# EAGLE design ESP8266_v2 (EAGLE 9.0.0)
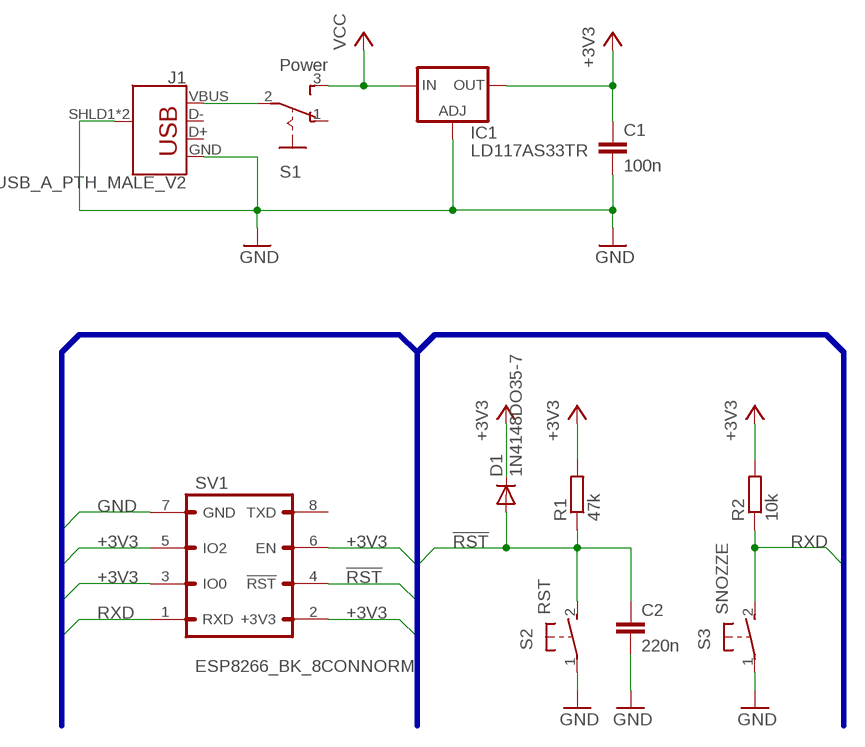
[diagram p0: schematic, sheet 1]

## Parts
C1  100n  C-EU050-025X075  [C050-025X075]
C2  220n  C-EU050-025X075  [C050-025X075]
D1  1N4148DO35-7  [DO35-7]
IC1  LD117AS33TR  [SOT223]
J1  USB_A_PTH_MALE_V2  [USB-A-H-V2]
R1  47k  R-EU_0204/5  [0204/5]
R2  10k  R-EU_0204/5  [0204/5]
S1  Power  255SBSMALL-H  [255SB-B]
S2  RST  SWITCH_2PIN  [DT6-1]
S3  SNOZZE  SWITCH_2PIN  [DT6-1]
SV1  ESP8266_BK_8CONNORM  [ESP8266_8CON]

## Nets
!RST: C2.1 D1.A R1.1 S2.2(S) SV1.4(!RST)
+3V3: C1.1 D1.C IC1.2(OUT) IC1.4(OUT) R1.2 R2.2 SV1.2(+3V3) SV1.3(IO0) SV1.5(IO2) SV1.6(EN)
GND: C1.2 C2.2 IC1.1(ADJ) J1.GND J1.SHLD1(SHIELD) J1.SHLD2(SHIELD) S2.1(P) S3.1(P) SV1.7(GND)
N$1: J1.VBUS S1.2(P)
RXD: R2.1 S3.2(S) SV1.1(RXD)
VCC: IC1.3(IN) S1.3(S)
Unconnected: J1.D+ J1.D- S1.1(O) SV1.8(TXD)

## Buses
VCC_0,VCC,VBUS,GND,+3V3,DTR,RXD,TXD,CTS,D+,D-,IO[0..2],!EN,!RST

## Library data of the parts
C1 C2 = Custom:C-EU: CAPACITOR, European symbol
D1 = Custom:1N4148: DIODE high speed (Philips)
IC1 = Custom:LD117A?*: Low drop fixed and adjustable positive voltage regulators 1 A Source: http://www.st.com/stonline/products/literature/ds/7194/ld1117axx.pdf
J1 = Custom:USB_A: USB-A Connector Male and female variants, as well as PTH and SMT variants SparkFun Products: SparkFun XBee Explorer Dongle <https://www.sparkfun.com/products/11697> PTH Male SparkFun MicroView-USB Programmer <https://www.sparkfun.com/products/12924> SMT Male SparkFun USB Type A Female Breakout <https://www.sparkfun.com/products/12700> SMT Female
R1 R2 = Custom:R-EU_: RESISTOR, European symbol
S1 = Custom:255SB: SLIDING SWITCH Distributor Buerklin, 11G810
S2 S3 = Custom:SWITCH_2PIN: ITT SWITCH
SV1 = Custom:ESP8266_BK_8CON: PIN HEADER

## Board
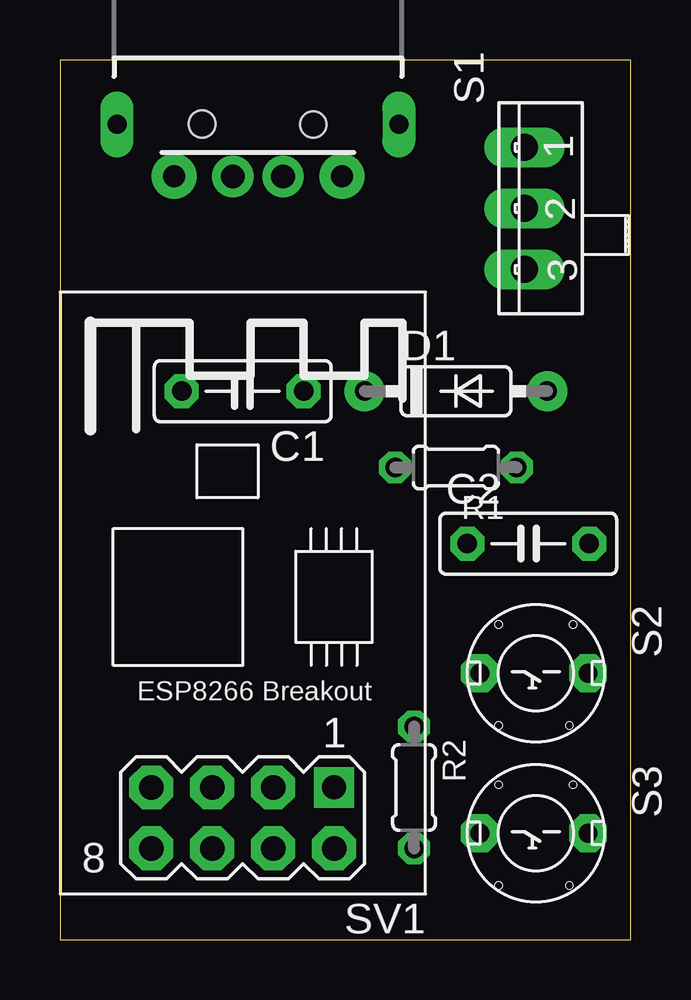
[diagram p1: board, top side]
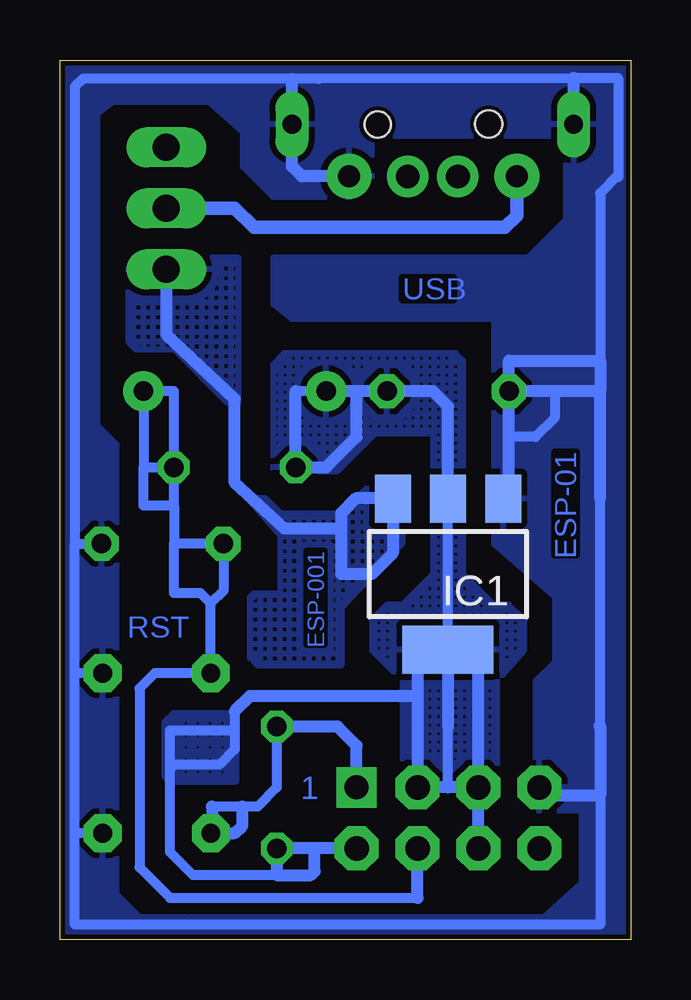
[diagram p2: board, bottom side, seen from below]

Size 23.8 x 36.66 mm. Coordinates in mm from the lower left corner, seen from the top.
Outline: 0,0 23.8,0 23.8,36.66 0,36.66 0,0
Copper layers (1*16): Top 0.035mm / dielectric 1.5mm / Bottom 0.035mm
Design rules "default *": minimum track width 6mil, minimum drill 0.35mm, track to track 6mil, track to pad 6mil, pad to pad 6mil, via to via 6mil, smd to smd 6mil, copper to edge 8mil, drill to drill 6mil, minimum pad ring 10mil, minimum via ring 8mil, stop-mask expansion 4mil, vias tented up to drill 0mil, thermal gap 10mil

### Footprints (pad centres in the part's own frame; a part is rotated, then mirrored left to right if it is on the bottom)
C050-025X075 = drill 0.813 pad 1.422 octagon: 1 -2.54,0; 2 2.54,0
DO35-7 = drill 0.813 pad 1.676: A 3.81,0; C -3.81,0
SOT223 = smd 1.5 x 2: 1 -2.3,-3.15; 2 0,-3.15; 3 2.3,-3.15 | smd 3.8 x 2: 4 0,3.15
USB-A-H-V2 = drill 0.991 pad 1.727: D+ 2.162,1.048; D- 2.162,-1.048 | drill 0.914 pad 1.88: GND 2.162,3.5; VBUS 2.162,-3.5 | drill 0.787 pad 1.372 long: SHLD1 -0.006,-5.874; SHLD2 -0.006,5.874 | hole 1.092: 0,2.302 | hole 1.118: -0.021,-2.329
0204/5 = drill 0.813 octagon: 1 -2.54,0; 2 2.54,0
255SB-B = drill 1.118 long: 1 -2.54,0; 2 0,0; 3 2.54,0
DT6-1 = drill 0.787 pad 1.575 octagon: 1 0,2.178; 2 0,-2.334
ESP8266_8CON = drill 1 pad 1.676 square: 1 -3.81,-1.27 | drill 1.016 pad 1.829 octagon: 2 -3.81,1.27; 3 -1.27,-1.27; 4 -1.27,1.27; 5 1.27,-1.27; 6 1.27,1.27; 7 3.81,-1.27; 8 3.81,1.27

### Placement (x,y rotation side)
C1  7.62,22.86 180 top
C2  19.53,16.51 0 top
D1  16.51,22.86 0 top
IC1  7.62,15.24 180 bottom
J1  8.26,33.97 270 top
R1  16.51,19.68 180 top
R2  14.76,6.35 270 top
S1  19.37,30.48 270 top
S2  19.84,11.11 270 top
S3  19.84,4.44 270 top
SV1  7.62,5.08 180 top

### Tracks (layer width: path | path; a pad name or v marks a point on that pad's centre or on a via)
!RST
  Bottom 0.406: 20.32,19.68 D1.A 19.05,22.86 R1.1 | 20.32,19.68 R1.1 | 19.05,18.1 R1.1 | 19.05,18.1 20.32,18.1 20.32,19.68 | 17.51,16.46 C2.1 | 8.89,1.75 19.21,1.75 20.48,3.02 20.48,10.48 19.84,11.11 S2.2 17.51,14.02 | C2.1 19.05,16.51 | 19.05,18.1 19.05,16.51 | C2.1 16.99,14.54 17.51,14.02 | 17.51,14.02 17.94,14.45 19.05,14.45 19.05,16.51
  Bottom 0.508: 8.89,1.75 SV1.4
+3V3
  Bottom 0.406: 6.35,12.07 7.59,12.07 IC1.4 | IC1.4 8.87,12.09 8.89,12.07 | IC1.4 IC1.2 | D1.C 13.97,22.86 | 8.89,10.32 9.05,10.16 | 19.21,7.14 19.21,8.73 16.51,8.73 | 19.21,7.14 19.21,3.65 18.26,2.7 14.76,2.7 | 16.51,9.53 16.51,8.73 | 16.51,8.73 16.51,7.94 17.14,7.3 19.05,7.3 19.21,7.14 | 8.57,6.35 8.89,6.67 | 7.62,6.35 7.62,10.16
  Bottom 0.508: IC1.2 7.62,22.22 8.26,22.86 C1.1 11.43,22.86 | 11.43,22.86 D1.C | SV1.6 SV1.5 | IC1.4 7.62,10.16 7.62,8.89 | SV1.5 6.35,12.07 | 8.89,12.07 8.89,10.32 8.89,6.67 SV1.3 | 11.43,22.86 11.43,20.95 12.7,19.68 R1.2 13.97,22.86 | SV1.2 13.18,3.81 | 13.18,3.81 R2.2 14.76,2.7 13.34,2.7 13.18,2.86 13.18,3.81 | 16.51,9.53 15.88,10.16 9.05,10.16 | SV1.5 7.62,6.35 8.57,6.35
  pour Bottom (hatched): 7.3,24.45 14.45,24.45 14.92,23.97 14.92,19.53 12.22,19.53 10.64,21.11 8.26,21.11 8.26,15.24 9.53,13.97 10.16,13.97 10.79,13.34 10.79,12.07 9.53,10.79 9.53,6.35 5.56,6.35 5.56,10.79 4.45,12.07 4.45,13.34 5.08,13.97 5.71,13.97 6.99,15.24 6.99,24.13
  pour Bottom (hatched): 16.51,9.37 19.05,9.37 19.37,9.05 19.37,6.83 19.05,6.67 16.51,6.67
GND
  Bottom 0.406: 23.18,16.51 23.18,35.56 22.86,35.88 14.13,35.88 13.02,35.88 2.38,35.91 2.25,35.91 0.52,35.91 0.52,31.79 0.52,31.87 1.27,31.12 1.27,24.13 | 23.18,16.51 C2.2 | 1.27,8.89 1.27,18.41 | 3.17,22.86 3.17,21.75 3.97,20.95 5.08,20.95 | 1.27,6.03 1.27,0.64 23.18,0.64 23.18,4.44 | 23.18,4.44 23.18,11.11 | 23.18,11.11 23.18,16.51 | S2.1 23.18,11.11 | S3.1 23.18,4.44
  Bottom 0.508: 1.27,22.86 1.27,24.13 5.08,24.13 C1.2 | 1.27,22.86 3.17,22.86 C1.2 | 1.27,18.41 1.27,22.86 | IC1.1 5.08,18.63 5.08,20.95 C1.2 | 1.29,8.92 1.27,8.89 1.27,6.03 3.81,6.03 SV1.7 | 14.13,35.88 J1.SHLD2 14.13,32.23 13.71,31.81 J1.GND | J1.SHLD1 2.38,35.91 | 2.38,35.91
  pour Bottom: 3.97,5.4 2.06,5.4 2.06,2.38 3.65,0.95 18.41,0.95 18.41,0 0,0 0,36.67 23.81,36.67 23.81,0 18.57,0 18.57,0.95 20.48,0.95 21.43,1.91 21.43,20.64 22.23,21.43 22.23,34.45 21.59,34.92 17.62,34.92 16.19,33.66 16.19,32.23 14.92,30.96 10.79,30.96 10.79,33.5 2.7,33.5 2.7,30 4.29,28.42 14.92,28.42 14.92,26.51 14.13,25.88 5.71,25.88 5.71,16.51 3.17,14.29 3.17,11.59 3.97,10.79
N$1
  Bottom 0.559: J1.VBUS 4.75,30.17 5.24,29.69 15.72,29.69 16.51,30.48 S1.2
RXD
  Bottom 0.406: R2.1 14.76,6.35 15.56,5.56 16.19,5.56 17.46,5.56 | 17.46,4.49 S3.2
  Bottom 0.508: SV1.1 11.43,8.1 12.22,8.89 R2.1 | 17.46,5.56 17.46,4.49 | S3.2 16.51,4.44 16.19,4.76 16.19,5.56
VCC
  Bottom 0.508: 12.06,17.14 14.45,17.14 16.51,19.05 16.51,22.54 19.37,25.24 S1.3 | 12.06,17.14 12.06,15.24 10.79,15.24 9.92,16.11 IC1.3 9.95,18.41 11.43,18.41 12.06,17.78 12.06,17.14
  pour Bottom (hatched): 9.53,19.05 9.53,16.51 12.06,13.81 12.06,11.43 15.56,11.43 15.88,11.75 15.88,14.29 15.72,14.45 14.61,14.45 14.61,16.83 15.88,18.26 15.88,18.41 15.24,18.41 14.61,17.78 12.06,17.78 10.79,19.05
  pour Bottom (hatched): 16.35,28.42 20.48,28.42 20.95,27.94 20.95,24.92 20.64,24.61 19.05,24.61 16.83,22.38 16.35,22.38

### Text on the board
Bottom: USB | ESP-01 | ESP-001 | RST | 1